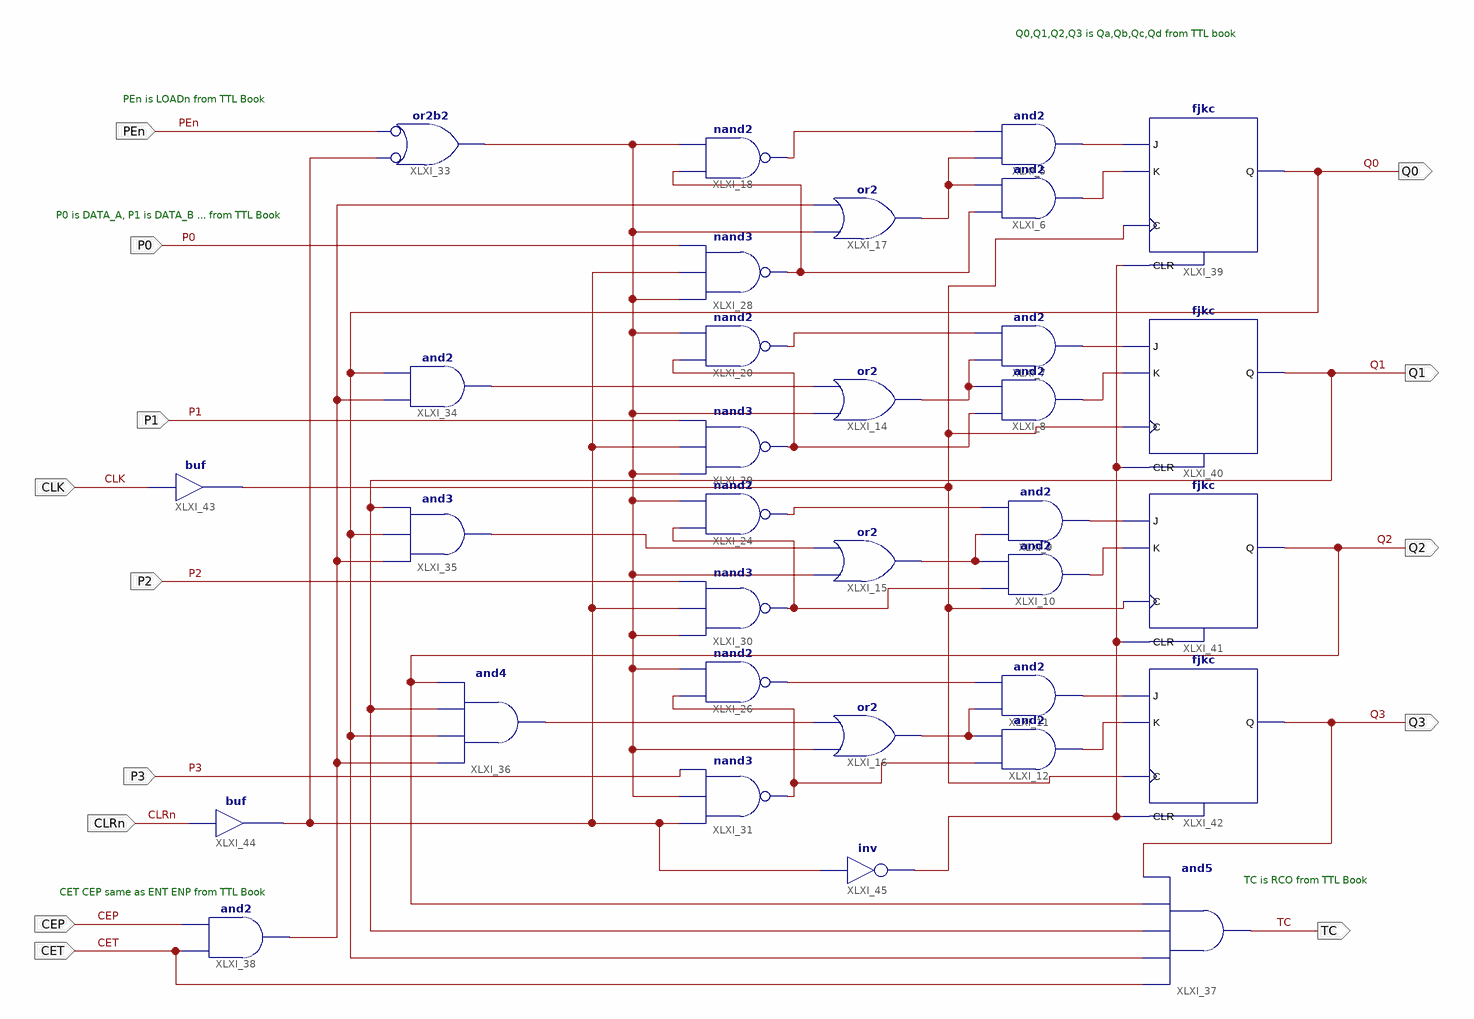
[diagram p0: schematic sheet 1]
// Xilinx ISE schematic chip74LS161.sch (spartan3e) as structural Verilog: 33 symbols, 14 ports
module chip74LS161 (
  input  CLK,
  input  CLRn,
  input  PEn,
  input  CEP,
  input  CET,
  input  P0,
  input  P1,
  input  P2,
  input  P3,
  output Q1,
  output Q2,
  output Q3,
  output TC,
  output Q0
);

  wire XLXN_11, XLXN_12, XLXN_13, XLXN_15, XLXN_17, XLXN_19, XLXN_21, XLXN_26, XLXN_28, XLXN_29, XLXN_35,
       XLXN_36, XLXN_44, XLXN_45, XLXN_48, XLXN_50, XLXN_54, XLXN_64, XLXN_65, XLXN_71, XLXN_72, XLXN_76,
       XLXN_77, XLXN_82, XLXN_83, XLXN_84, XLXN_86, XLXN_87;

  and XLXI_5 (XLXN_64, XLXN_86, XLXN_15);
  and XLXI_6 (XLXN_65, XLXN_35, XLXN_86);
  and XLXI_7 (XLXN_71, XLXN_11, XLXN_17);
  and XLXI_8 (XLXN_72, XLXN_26, XLXN_11);
  and XLXI_9 (XLXN_76, XLXN_12, XLXN_19);
  and XLXI_10 (XLXN_77, XLXN_28, XLXN_12);
  and XLXI_11 (XLXN_82, XLXN_13, XLXN_21);
  and XLXI_12 (XLXN_83, XLXN_29, XLXN_13);
  or XLXI_14 (XLXN_11, XLXN_36, XLXN_45);
  or XLXI_15 (XLXN_12, XLXN_36, XLXN_48);
  or XLXI_16 (XLXN_13, XLXN_36, XLXN_50);
  or XLXI_17 (XLXN_86, XLXN_36, XLXN_54);
  nand XLXI_18 (XLXN_15, XLXN_35, XLXN_36);
  nand XLXI_20 (XLXN_17, XLXN_26, XLXN_36);
  nand XLXI_24 (XLXN_19, XLXN_28, XLXN_36);
  nand XLXI_26 (XLXN_21, XLXN_29, XLXN_36);
  nand XLXI_28 (XLXN_35, XLXN_36, XLXN_44, P0);
  nand XLXI_29 (XLXN_26, XLXN_36, XLXN_44, P1);
  nand XLXI_30 (XLXN_28, XLXN_36, XLXN_44, P2);
  nand XLXI_31 (XLXN_29, XLXN_44, XLXN_36, P3);
  or XLXI_33 (XLXN_36, ~XLXN_44, ~PEn);  // or2b2
  and XLXI_34 (XLXN_45, XLXN_54, Q0);
  and XLXI_35 (XLXN_48, XLXN_54, Q0, Q1);
  and XLXI_36 (XLXN_50, XLXN_54, Q0, Q1, Q2);
  and XLXI_37 (TC, CET, Q0, Q1, Q2, Q3);
  and XLXI_38 (XLXN_54, CET, CEP);
  fjkc XLXI_39 (.C(XLXN_84), .CLR(XLXN_87), .J(XLXN_64), .K(XLXN_65), .Q(Q0));
  fjkc XLXI_40 (.C(XLXN_84), .CLR(XLXN_87), .J(XLXN_71), .K(XLXN_72), .Q(Q1));
  fjkc XLXI_41 (.C(XLXN_84), .CLR(XLXN_87), .J(XLXN_76), .K(XLXN_77), .Q(Q2));
  fjkc XLXI_42 (.C(XLXN_84), .CLR(XLXN_87), .J(XLXN_82), .K(XLXN_83), .Q(Q3));
  buf XLXI_43 (XLXN_84, CLK);
  buf XLXI_44 (XLXN_44, CLRn);
  not XLXI_45 (XLXN_87, XLXN_44);

  // Notes on the sheet:
  //   Q0,Q1,Q2,Q3 is Qa,Qb,Qc,Qd from TTL book
  //   PEn is LOADn from TTL Book
  //   P0 is DATA_A, P1 is DATA_B ... from TTL Book
  //   TC is RCO from TTL Book
  //   CET CEP same as ENT ENP from TTL Book
endmodule
